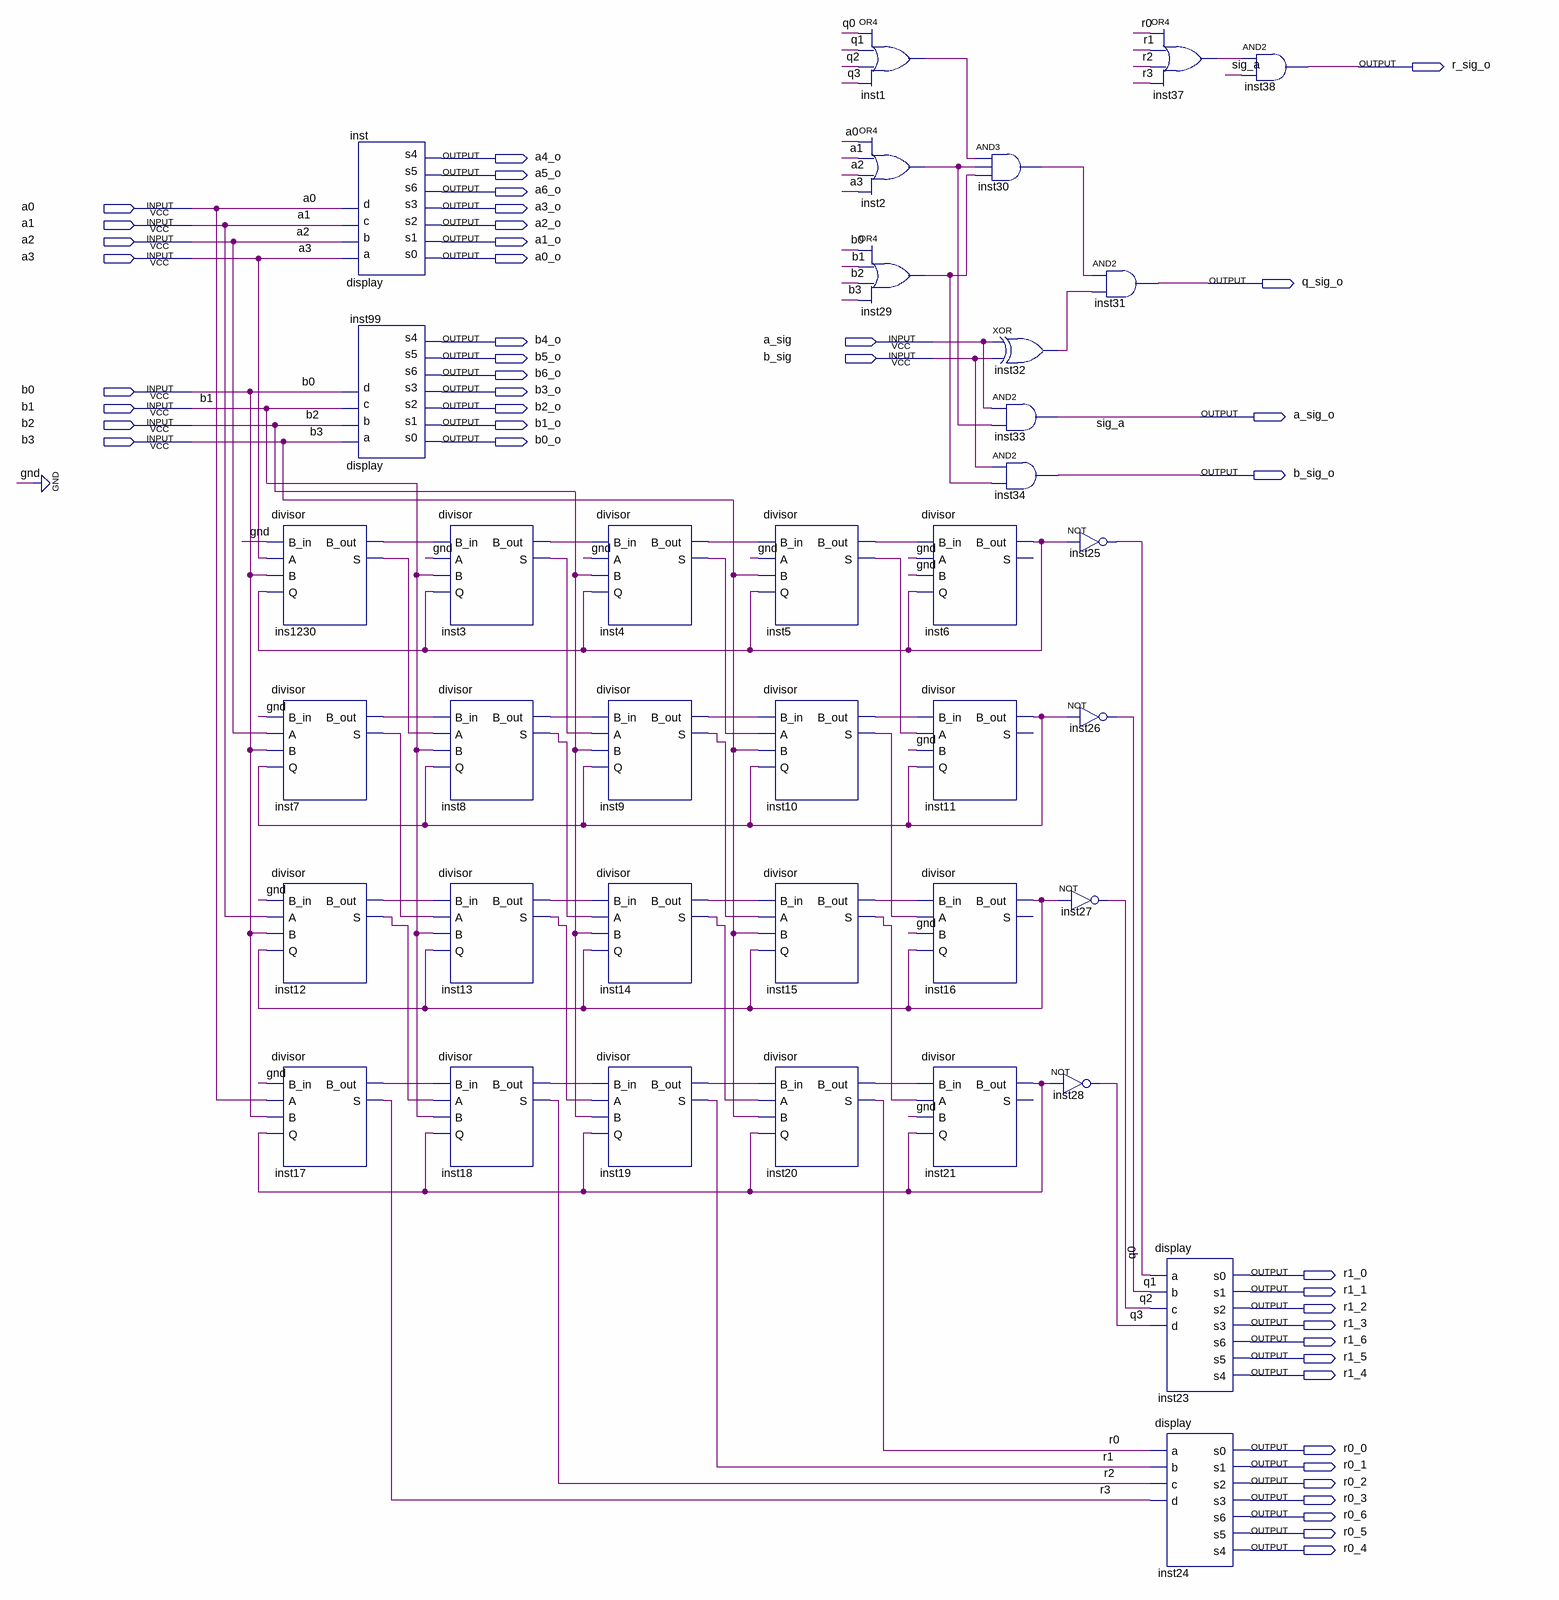
[diagram p0: schematic sheet]
// Quartus schematic AULA11.bdf as structural Verilog: 38 symbols, 42 pins
module AULA11 (
  input  a0,
  input  a1,
  input  a2,
  input  a3,
  input  a_sig,
  input  b_sig,
  input  b0,
  input  b1,
  input  b2,
  input  b3,
  output r_sig_o,
  output a4_o,
  output a5_o,
  output a6_o,
  output a3_o,
  output a2_o,
  output a1_o,
  output a0_o,
  output q_sig_o,
  output b4_o,
  output b5_o,
  output b6_o,
  output b3_o,
  output b2_o,
  output a_sig_o,
  output b1_o,
  output b0_o,
  output b_sig_o,
  output r1_0,
  output r1_1,
  output r1_2,
  output r1_3,
  output r1_6,
  output r1_5,
  output r1_4,
  output r0_0,
  output r0_1,
  output r0_2,
  output r0_3,
  output r0_6,
  output r0_5,
  output r0_4
);

  wire ins1230_b_out, ins1230_s, inst1_out, inst2_out, inst3_b_out, inst3_s, inst4_b_out, inst4_s,
       inst5_b_out, inst5_s, inst6_b_out, inst7_b_out, inst7_s, inst8_b_out, inst8_s, inst9_b_out, inst9_s,
       inst10_b_out, inst10_s, inst11_b_out, inst12_b_out, inst12_s, inst13_b_out, inst13_s, inst14_b_out,
       inst14_s, inst15_b_out, inst15_s, inst16_b_out, inst17_b_out, inst18_b_out, inst19_b_out,
       inst20_b_out, inst21_b_out, inst29_out, inst30_out, inst32_out, inst37_out, q0, q1, q2, q3, r0, r1,
       r2, r3;

  divisor ins1230 (.B_in(1'b0), .A(a3), .B(b0), .Q(inst6_b_out), .B_out(ins1230_b_out), .S(ins1230_s));
  divisor inst7 (.B_in(1'b0), .A(a2), .B(b0), .Q(inst11_b_out), .B_out(inst7_b_out), .S(inst7_s));
  divisor inst12 (.B_in(1'b0), .A(a1), .B(b0), .Q(inst16_b_out), .B_out(inst12_b_out), .S(inst12_s));
  divisor inst17 (.B_in(1'b0), .A(a0), .B(b0), .Q(inst21_b_out), .B_out(inst17_b_out), .S(r3));
  display inst (
    .a(a3), .b(a2), .c(a1), .d(a0), .s0(a0_o), .s1(a1_o), .s2(a2_o), .s3(a3_o), .s6(a6_o), .s5(a5_o),
    .s4(a4_o));
  display inst99 (
    .a(b3), .b(b2), .c(b1), .d(b0), .s0(b0_o), .s1(b1_o), .s2(b2_o), .s3(b3_o), .s6(b6_o), .s5(b5_o),
    .s4(b4_o));
  divisor inst3 (.B_in(ins1230_b_out), .A(1'b0), .B(b1), .Q(inst6_b_out), .B_out(inst3_b_out), .S(inst3_s));
  divisor inst8 (.B_in(inst7_b_out), .A(ins1230_s), .B(b1), .Q(inst11_b_out), .B_out(inst8_b_out), .S(inst8_s));
  divisor inst13 (.B_in(inst12_b_out), .A(inst7_s), .B(b1), .Q(inst16_b_out), .B_out(inst13_b_out), .S(inst13_s));
  divisor inst18 (.B_in(inst17_b_out), .A(inst12_s), .B(b1), .Q(inst21_b_out), .B_out(inst18_b_out), .S(r2));
  divisor inst4 (.B_in(inst3_b_out), .A(1'b0), .B(b2), .Q(inst6_b_out), .B_out(inst4_b_out), .S(inst4_s));
  divisor inst9 (.B_in(inst8_b_out), .A(inst3_s), .B(b2), .Q(inst11_b_out), .B_out(inst9_b_out), .S(inst9_s));
  divisor inst14 (.B_in(inst13_b_out), .A(inst8_s), .B(b2), .Q(inst16_b_out), .B_out(inst14_b_out), .S(inst14_s));
  divisor inst19 (.B_in(inst18_b_out), .A(inst13_s), .B(b2), .Q(inst21_b_out), .B_out(inst19_b_out), .S(r1));
  divisor inst5 (.B_in(inst4_b_out), .A(1'b0), .B(b3), .Q(inst6_b_out), .B_out(inst5_b_out), .S(inst5_s));
  divisor inst10 (.B_in(inst9_b_out), .A(inst4_s), .B(b3), .Q(inst11_b_out), .B_out(inst10_b_out), .S(inst10_s));
  divisor inst15 (.B_in(inst14_b_out), .A(inst9_s), .B(b3), .Q(inst16_b_out), .B_out(inst15_b_out), .S(inst15_s));
  divisor inst20 (.B_in(inst19_b_out), .A(inst14_s), .B(b3), .Q(inst21_b_out), .B_out(inst20_b_out), .S(r0));
  or inst1 (inst1_out, q0, q1, q2, q3);
  or inst2 (inst2_out, a0, a1, a2, a3);
  or inst29 (inst29_out, b0, b1, b2, b3);
  divisor inst6 (.B_in(inst5_b_out), .A(1'b0), .B(1'b0), .Q(inst6_b_out), .B_out(inst6_b_out));  // open: S
  divisor inst11 (.B_in(inst10_b_out), .A(inst5_s), .B(1'b0), .Q(inst11_b_out), .B_out(inst11_b_out));  // open: S
  divisor inst16 (.B_in(inst15_b_out), .A(inst10_s), .B(1'b0), .Q(inst16_b_out), .B_out(inst16_b_out));  // open: S
  divisor inst21 (.B_in(inst20_b_out), .A(inst15_s), .B(1'b0), .Q(inst21_b_out), .B_out(inst21_b_out));  // open: S
  and inst30 (inst30_out, inst1_out, inst2_out, inst29_out);
  xor inst32 (inst32_out, a_sig, b_sig);
  and inst33 (a_sig_o, a_sig, inst2_out);
  and inst34 (b_sig_o, b_sig, inst29_out);
  and inst31 (q_sig_o, inst30_out, inst32_out);
  not inst25 (q0, inst6_b_out);
  not inst26 (q1, inst11_b_out);
  not inst27 (q2, inst16_b_out);
  not inst28 (q3, inst21_b_out);
  or inst37 (inst37_out, r0, r1, r2, r3);
  display inst23 (
    .a(q0), .b(q1), .c(q2), .d(q3), .s0(r1_0), .s1(r1_1), .s2(r1_2), .s3(r1_3), .s6(r1_6), .s5(r1_5),
    .s4(r1_4));
  display inst24 (
    .a(r0), .b(r1), .c(r2), .d(r3), .s0(r0_0), .s1(r0_1), .s2(r0_2), .s3(r0_3), .s6(r0_6), .s5(r0_5),
    .s4(r0_4));
  and inst38 (r_sig_o, inst37_out, a_sig_o);

  // Other names for the same wires on the sheet: sig_a = a_sig_o
endmodule
